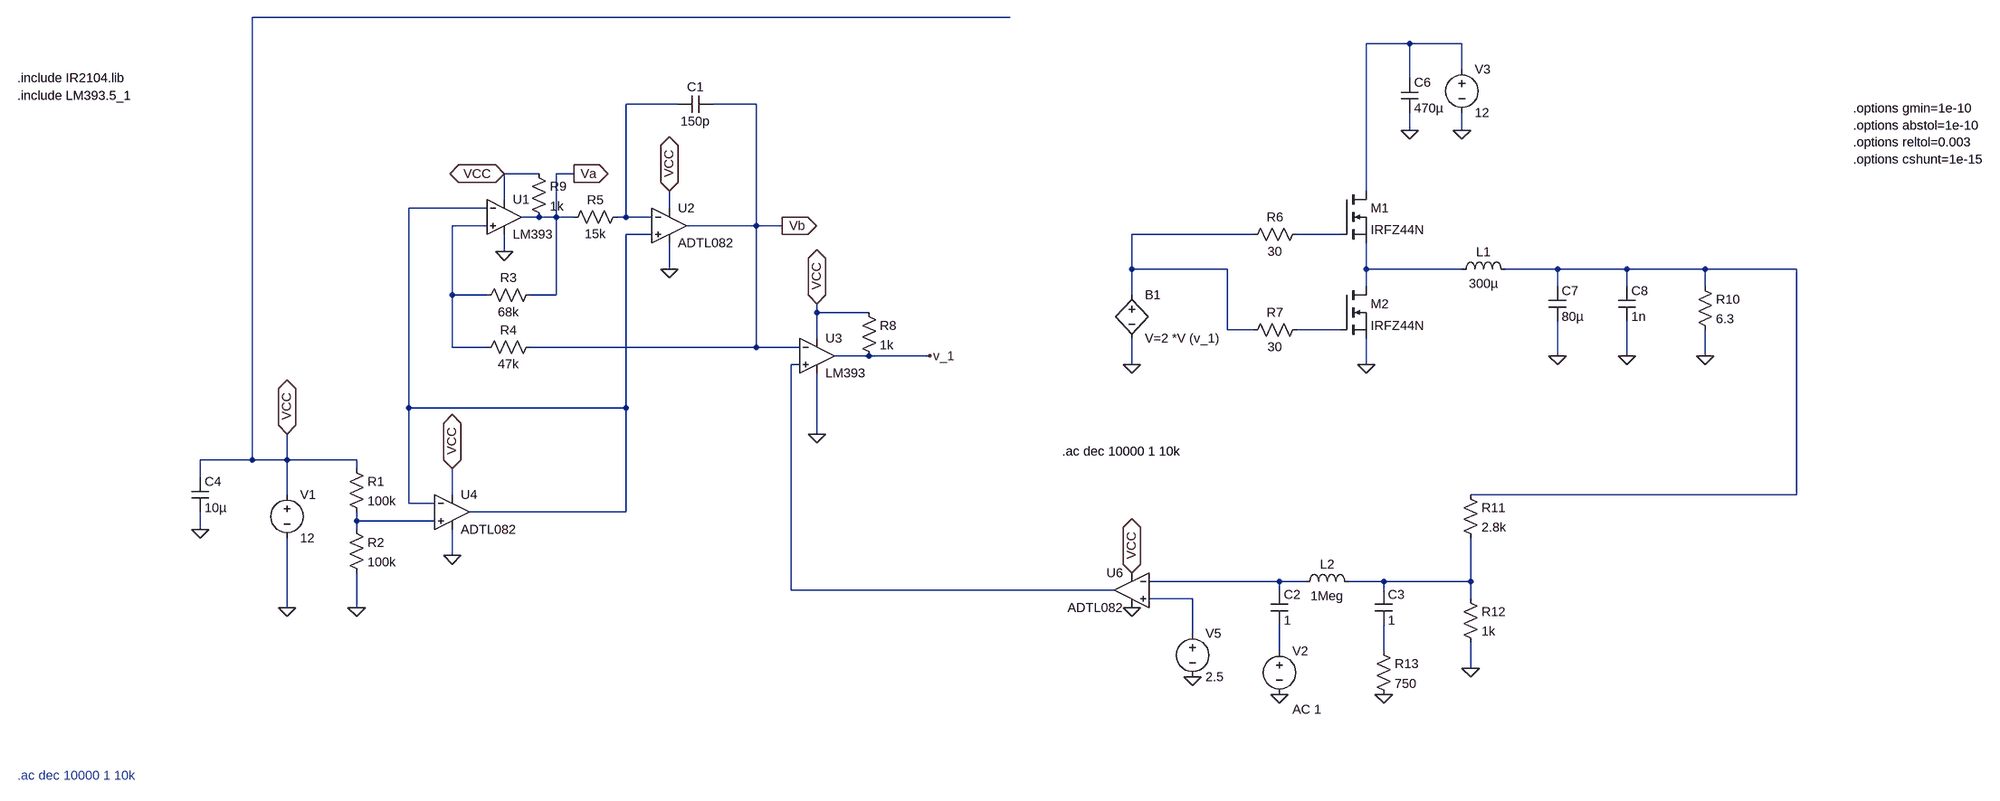
[diagram p0: schematic cierre_lazo_cami.asc]
cierre_lazo_cami.asc, the LTspice schematic file:
Version 4
SHEET 1 2820 680
WIRE 928 -1104 -816 -1104
WIRE 1664 -1056 1584 -1056
WIRE 1760 -1056 1664 -1056
WIRE 1760 -1008 1760 -1056
WIRE 1664 -992 1664 -1056
WIRE -32 -944 -128 -944
WIRE 112 -944 32 -944
WIRE 1664 -896 1664 -928
WIRE 1760 -896 1760 -928
WIRE -288 -816 -352 -816
WIRE -224 -816 -256 -816
WIRE 1584 -784 1584 -1056
WIRE -352 -768 -352 -816
WIRE -384 -752 -528 -752
WIRE -48 -752 -48 -784
WIRE -288 -736 -320 -736
WIRE -256 -736 -256 -816
WIRE -256 -736 -288 -736
WIRE -224 -736 -256 -736
WIRE -128 -736 -128 -944
WIRE -128 -736 -144 -736
WIRE -80 -736 -128 -736
WIRE -384 -720 -448 -720
WIRE 112 -720 112 -944
WIRE 112 -720 -16 -720
WIRE 160 -720 112 -720
WIRE -80 -704 -128 -704
WIRE 1376 -704 1152 -704
WIRE 1536 -704 1456 -704
WIRE -352 -672 -352 -704
WIRE -48 -640 -48 -688
WIRE 1152 -640 1152 -704
WIRE 1328 -640 1152 -640
WIRE 1584 -640 1584 -688
WIRE 1760 -640 1584 -640
WIRE 1936 -640 1840 -640
WIRE 2064 -640 1936 -640
WIRE 2208 -640 2064 -640
WIRE 2448 -640 2208 -640
WIRE 1584 -608 1584 -640
WIRE 1936 -608 1936 -640
WIRE 2064 -608 2064 -640
WIRE 2208 -608 2208 -640
WIRE -448 -592 -448 -720
WIRE -384 -592 -448 -592
WIRE -256 -592 -256 -736
WIRE -256 -592 -304 -592
WIRE 1152 -592 1152 -640
WIRE 224 -560 224 -576
WIRE 320 -560 224 -560
WIRE 1328 -528 1328 -640
WIRE 1376 -528 1328 -528
WIRE 1536 -528 1456 -528
WIRE 224 -512 224 -560
WIRE -448 -496 -448 -592
WIRE -384 -496 -448 -496
WIRE 112 -496 112 -720
WIRE 112 -496 -304 -496
WIRE 192 -496 112 -496
WIRE 320 -480 256 -480
WIRE 432 -480 320 -480
WIRE 1936 -480 1936 -544
WIRE 2064 -480 2064 -544
WIRE 2208 -480 2208 -528
WIRE 192 -464 176 -464
WIRE 1152 -464 1152 -512
WIRE 1584 -464 1584 -512
WIRE -528 -384 -528 -752
WIRE -128 -384 -128 -704
WIRE -128 -384 -528 -384
WIRE 224 -336 224 -448
WIRE -816 -288 -816 -1104
WIRE -816 -288 -912 -288
WIRE -752 -288 -752 -336
WIRE -752 -288 -816 -288
WIRE -624 -288 -752 -288
WIRE -624 -272 -624 -288
WIRE -912 -256 -912 -288
WIRE -752 -224 -752 -288
WIRE -448 -224 -448 -272
WIRE 2448 -224 2448 -640
WIRE 2448 -224 1776 -224
WIRE -528 -208 -528 -384
WIRE -480 -208 -528 -208
WIRE -128 -192 -128 -384
WIRE -128 -192 -416 -192
WIRE -624 -176 -624 -192
WIRE -480 -176 -624 -176
WIRE -912 -160 -912 -192
WIRE -624 -160 -624 -176
WIRE -448 -112 -448 -160
WIRE 1424 -64 1184 -64
WIRE 1472 -64 1424 -64
WIRE 1616 -64 1552 -64
WIRE 1776 -64 1776 -144
WIRE 1776 -64 1616 -64
WIRE 176 -48 176 -464
WIRE 1120 -48 176 -48
WIRE 1424 -48 1424 -64
WIRE 1616 -48 1616 -64
WIRE 1264 -32 1184 -32
WIRE 1776 -32 1776 -64
WIRE -752 -16 -752 -144
WIRE -624 -16 -624 -80
WIRE 1264 32 1264 -32
WIRE 1424 64 1424 16
WIRE 1616 64 1616 16
WIRE 1776 96 1776 48
FLAG -624 -16 0
FLAG -752 -16 0
FLAG -48 -640 0
FLAG -448 -112 0
FLAG 224 -336 0
FLAG -352 -672 0
FLAG -752 -336 VCC
IOPIN -752 -336 BiDir
FLAG -352 -816 VCC
IOPIN -352 -816 BiDir
FLAG -48 -784 VCC
IOPIN -48 -784 BiDir
FLAG -448 -272 VCC
IOPIN -448 -272 BiDir
FLAG -224 -816 Va
IOPIN -224 -816 Out
FLAG 160 -720 Vb
IOPIN 160 -720 Out
FLAG 224 -576 VCC
IOPIN 224 -576 BiDir
FLAG -912 -160 0
FLAG 1584 -464 0
FLAG 1760 -896 0
FLAG 1664 -896 0
FLAG 1936 -480 0
FLAG 2064 -480 0
FLAG 2208 -480 0
FLAG 1776 96 0
FLAG 1152 -80 VCC
IOPIN 1152 -80 BiDir
FLAG 1264 112 0
FLAG 1616 144 0
FLAG 1424 144 0
FLAG 1152 -16 0
FLAG 1152 -464 0
FLAG 432 -480 v_1
SYMBOL res -128 -752 R90
WINDOW 0 0 56 VBottom 2
WINDOW 3 32 56 VTop 2
SYMATTR InstName R5
SYMATTR Value 15k
SYMBOL res -640 -288 R0
SYMATTR InstName R1
SYMATTR Value 100k
SYMBOL res -640 -176 R0
SYMATTR InstName R2
SYMATTR Value 100k
SYMBOL voltage -752 -240 R0
WINDOW 123 0 0 Left 0
WINDOW 39 0 0 Left 0
SYMATTR InstName V1
SYMATTR Value 12
SYMBOL res -288 -608 R90
WINDOW 0 0 56 VBottom 2
WINDOW 3 32 56 VTop 2
SYMATTR InstName R3
SYMATTR Value 68k
SYMBOL res -288 -512 R90
WINDOW 0 0 56 VBottom 2
WINDOW 3 32 56 VTop 2
SYMATTR InstName R4
SYMATTR Value 47k
SYMBOL cap 32 -960 R90
WINDOW 0 0 32 VBottom 2
WINDOW 3 32 32 VTop 2
SYMATTR InstName C1
SYMATTR Value 150p
SYMBOL OpAmps\\opamp2 224 -544 R0
SYMATTR InstName U3
SYMATTR Value LM393
SYMBOL OpAmps\\opamp2 -352 -800 R0
SYMATTR InstName U1
SYMATTR Value LM393
SYMBOL res 304 -576 R0
SYMATTR InstName R8
SYMATTR Value 1k
SYMBOL res -304 -832 R0
SYMATTR InstName R9
SYMATTR Value 1k
SYMBOL OpAmps\\ADTL082 -48 -784 R0
SYMATTR InstName U2
SYMBOL OpAmps\\ADTL082 -448 -256 R0
SYMATTR InstName U4
SYMBOL cap -928 -256 R0
SYMATTR InstName C4
SYMATTR Value 10µ
SYMBOL res 1472 -720 R90
WINDOW 0 0 56 VBottom 2
WINDOW 3 32 56 VTop 2
SYMATTR InstName R6
SYMATTR Value 30
SYMBOL res 1472 -544 R90
WINDOW 0 0 56 VBottom 2
WINDOW 3 32 56 VTop 2
SYMATTR InstName R7
SYMATTR Value 30
SYMBOL nmos 1536 -784 R0
SYMATTR InstName M1
SYMATTR Value IRFZ44N
SYMBOL nmos 1536 -608 R0
SYMATTR InstName M2
SYMATTR Value IRFZ44N
SYMBOL voltage 1760 -1024 R0
SYMATTR InstName V3
SYMATTR Value 12
SYMBOL cap 1648 -992 R0
SYMATTR InstName C6
SYMATTR Value 470µ
SYMBOL ind 1744 -624 R270
WINDOW 0 32 56 VTop 2
WINDOW 3 5 56 VBottom 2
SYMATTR InstName L1
SYMATTR Value 300µ
SYMBOL cap 1920 -608 R0
SYMATTR InstName C7
SYMATTR Value 80µ
SYMBOL cap 2048 -608 R0
SYMATTR InstName C8
SYMATTR Value 1n
SYMBOL res 2192 -624 R0
SYMATTR InstName R10
SYMATTR Value 6.3
SYMBOL res 1760 -240 R0
SYMATTR InstName R11
SYMATTR Value 2.8k
SYMBOL res 1760 -48 R0
SYMATTR InstName R12
SYMATTR Value 1k
SYMBOL OpAmps\\ADTL082 1152 -112 M0
SYMATTR InstName U6
SYMBOL voltage 1264 16 R0
SYMATTR InstName V5
SYMATTR Value 2.5
SYMBOL ind 1456 -48 R270
WINDOW 0 32 56 VTop 2
WINDOW 3 5 56 VBottom 2
SYMATTR InstName L2
SYMATTR Value 1Meg
SYMBOL cap 1408 -48 R0
SYMATTR InstName C2
SYMATTR Value 1
SYMBOL cap 1600 -48 R0
SYMATTR InstName C3
SYMATTR Value 1
SYMBOL res 1600 48 R0
SYMATTR InstName R13
SYMATTR Value 750
SYMBOL voltage 1424 48 R0
WINDOW 123 24 124 Left 2
WINDOW 39 0 0 Left 0
SYMATTR InstName V2
SYMATTR Value ""
SYMATTR Value2 AC 1
SYMBOL bv 1152 -608 R0
SYMATTR InstName B1
SYMATTR Value V=2 *V (v_1)
TEXT 1024 -304 Left 2 !.ac dec 10000 1 10k
TEXT -1472 -992 Left 2 !.include IR2104.lib
TEXT -1472 -960 Left 2 !.include LM393.5_1
TEXT 2552 -936 Left 2 !.options gmin=1e-10\n.options abstol=1e-10\n.options reltol=0.003\n.options cshunt=1e-15
TEXT -1472 312 Left 2 ;.ac dec 10000 1 10k

The netlist it stands for:
* cierre_lazo_cami.asc
R5 N002 Va 15k
R1 VCC N011 100k
R2 N011 0 100k
V1 VCC 0 12
R3 Va N004 68k
R4 Vb N004 47k
C1 Vb N002 150p
XU3 N010 Vb VCC 0 v_1 LM393  ; pins In+ In- V+ V- OUT
XU1 N004 N003 VCC 0 Va LM393  ; pins In+ In- V+ V- OUT
R8 VCC v_1 1k
R9 VCC Va 1k
XU2 N003 N002 VCC 0 Vb ADTL082  ; pins In+ In- V+ V- OUT
XU4 N011 N003 VCC 0 N003 ADTL082  ; pins In+ In- V+ V- OUT
C4 VCC 0 10µ
R6 N006 N005 30
R7 N009 N005 30
M1 N001 N006 N007 N007 IRFZ44N
M2 N007 N009 0 0 IRFZ44N
V3 N001 0 12
C6 N001 0 470µ
L1 N007 N008 300µ
C7 N008 0 80µ
C8 N008 0 1n
R10 N008 0 6.3
R11 N008 N013 2.8k
R12 N013 0 1k
XU6 N014 N012 VCC 0 N010 ADTL082  ; pins In+ In- V+ V- OUT
V5 N014 0 2.5
L2 N012 N013 1Meg
C2 N012 N015 1
C3 N013 N016 1
R13 N016 0 750
V2 N015 0 AC 1
B1 N005 0 V=2 *V (v_1)
.model NMOS NMOS
.model PMOS PMOS
.lib standard.mos
.ac dec 10000 1 10k
.include IR2104.lib
.include LM393.5_1
.options gmin=1e-10
.options abstol=1e-10
.options reltol=0.003
.options cshunt=1e-15
* .ac dec 10000 1 10k
.lib ADI.lib
.backanno
.end